# Altium project BIG_FPGA.PrjPcb (part 1 of 2)
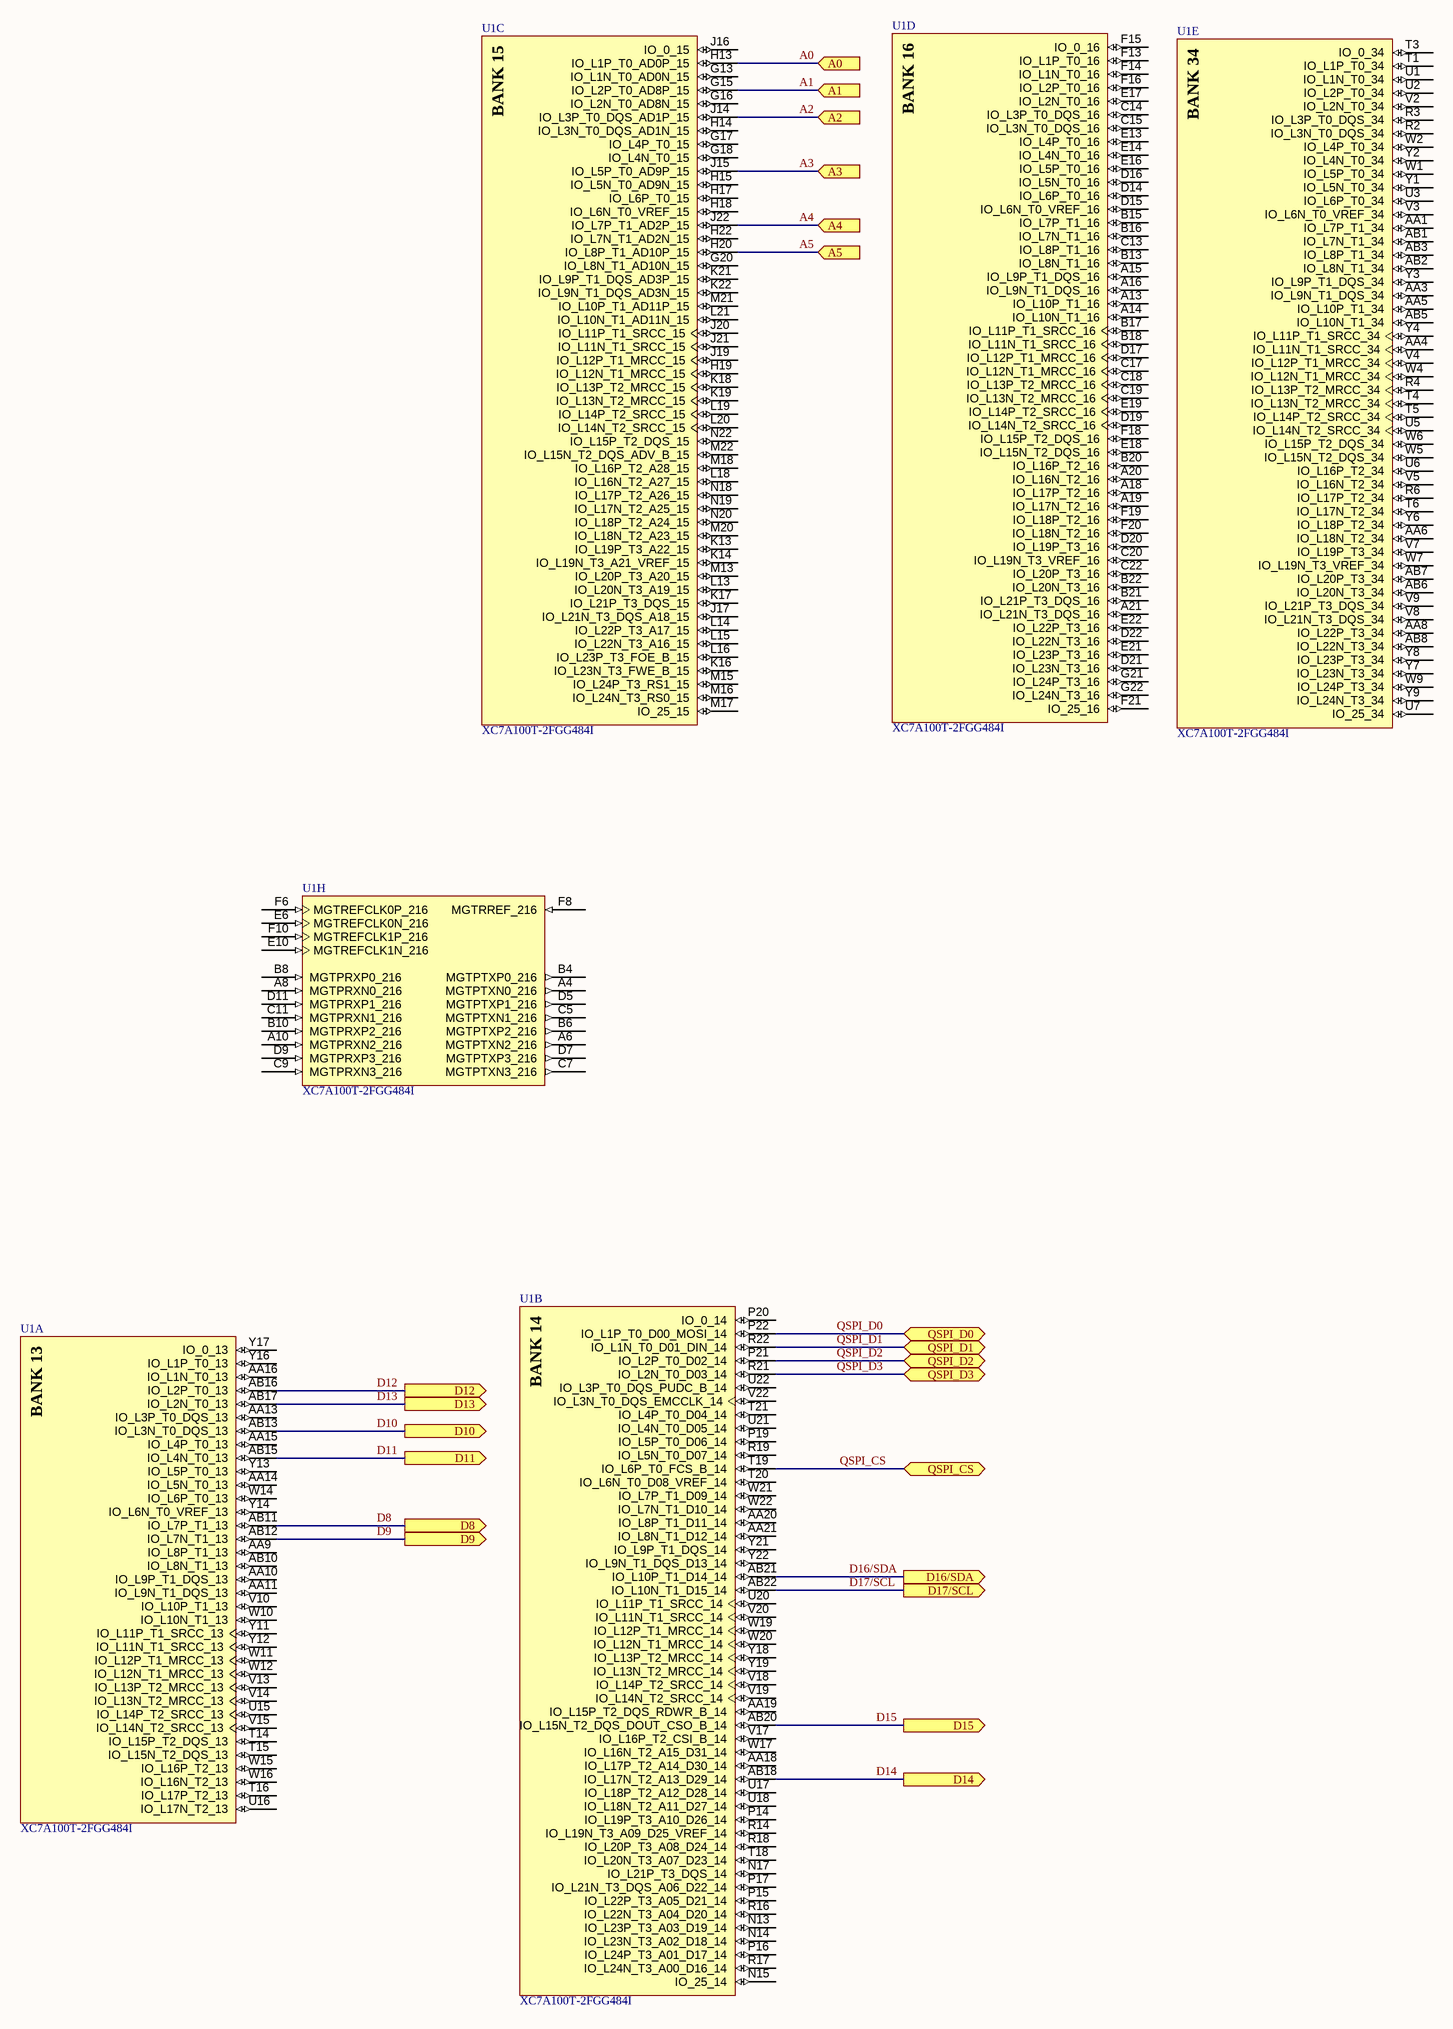
[diagram p0: Sheet1.SchDoc]
CAGE_CODE: ?????; CONTRACT_NUMBER: <CONTRACT NO>; DOC_NO_ASSY_DWG: <ASSY DWG NO>; DOC_NO_BOM: <BOM DOC NO>; DOC_NO_FAB_DWG: <FAB DWG NO>; DOC_NO_SCH_DWG: <SCH DWG NO>; PCB_2_DEC_TOL: +/-.01; PCB_3_DEC_TOL: +/-.010; PCB_ANG_TOL: +/-1/2; PCB_ASSEMBLY_NO: <PCB ASSY NO>; PCB_CHECKER: - -----; PCB_CHECKER_APP_DATE: --/--/----; PCB_DESIGNER: - -----; PCB_DESIGNER_APP_DATE: --/--/----; PCB_DWG_NO: <PCB DWG NO>; PCB_ENGINEER: - -----; PCB_ENGINEER_APP_DATE: --/--/----; PCB_PART_NUMBER: <PCB PN>; PCB_REV: A; SCH_REV: A
7 sheets, 204 parts. Net scope: flat (ports and power ports of the same name join across sheets).
Board file: PCB1.PcbDoc
Sheets:
  Sheet1.SchDoc
  FPGA_PD.SchDoc
  FPGA_DECOUP.SchDoc
  FPGA_ETH.SchDoc
  FPGA_USB.SchDoc
  FPGA_AUDIO.SchDoc
  FPGA_DDR3_Interface.SchDoc

## Sheet Sheet1.SchDoc
size 558 x 431 mm; SheetNumber: 1; SheetTotal: 9; ENG_APP_DATE: --/--/--; DSN_APP_DATE: --/--/--; CHK_APP_DATE: --/--/--

### Parts
U1  XC7A100T-2FGG484I  [FGG484]  (parts A,B,C,D,E,H of 10)

### Ports
A0 (in), A1 (in), A2 (in), A3 (in), A4 (in), A5 (in), D8 (out), D9 (out), D10 (out), D11 (out), D12 (out), D13 (out), D14 (out), D15 (out), D16/SDA (out), D17/SCL (out), QSPI_CS (bidir), QSPI_D0 (bidir), QSPI_D1 (bidir), QSPI_D2 (bidir), QSPI_D3 (bidir)

### Nets
A0: U1.H13(IO_L1P_T0_AD0P_15) ; port A0
A1: U1.G15(IO_L2P_T0_AD8P_15) ; port A1
A2: U1.J14(IO_L3P_T0_DQS_AD1P_15) ; port A2
A3: U1.J15(IO_L5P_T0_AD9P_15) ; port A3
A4: U1.J22(IO_L7P_T1_AD2P_15) ; port A4
A5: U1.H20(IO_L8P_T1_AD10P_15) ; port A5
D8: U1.AB11(IO_L7P_T1_13) ; port D8
D9: U1.AB12(IO_L7N_T1_13) ; port D9
D10: U1.AB13(IO_L3N_T0_DQS_13) ; port D10
D11: U1.AB15(IO_L4N_T0_13) ; port D11
D12: U1.AB16(IO_L2P_T0_13) ; port D12
D13: U1.AB17(IO_L2N_T0_13) ; port D13
D14: U1.AB18(IO_L17N_T2_A13_D29_14) ; port D14
D15: U1.AB20(IO_L15N_T2_DQS_DOUT_CSO_B_14) ; port D15
D16/SDA: U1.AB21(IO_L10P_T1_D14_14) ; port D16/SDA
D17/SCL: U1.AB22(IO_L10N_T1_D15_14) ; port D17/SCL
QSPI_CS: U1.T19(IO_L6P_T0_FCS_B_14) ; port QSPI_CS
QSPI_D0: U1.P22(IO_L1P_T0_D00_MOSI_14) ; port QSPI_D0
QSPI_D1: U1.R22(IO_L1N_T0_D01_DIN_14) ; port QSPI_D1
QSPI_D2: U1.P21(IO_L2P_T0_D02_14) ; port QSPI_D2
QSPI_D3: U1.R21(IO_L2N_T0_D03_14) ; port QSPI_D3

Not connected (* = marked no-connect by the designer): U1 A4(MGTPTXN0_216) A6(MGTPTXN2_216) A8(MGTPRXN0_216) A10(MGTPRXN2_216) A13(IO_L10P_T1_16) A14(IO_L10N_T1_16) A15(IO_L9P_T1_DQS_16) A16(IO_L9N_T1_DQS_16) A18(IO_L17P_T2_16) A19(IO_L17N_T2_16) A20(IO_L16N_T2_16) A21(IO_L21N_T3_DQS_16) AA1(IO_L7P_T1_34) AA3(IO_L9N_T1_DQS_34) AA4(IO_L11N_T1_SRCC_34) AA5(IO_L10P_T1_34) AA6(IO_L18N_T2_34) AA8(IO_L22P_T3_34) AA9(IO_L8P_T1_13) AA10(IO_L9P_T1_DQS_13) AA11(IO_L9N_T1_DQS_13) AA13(IO_L3P_T0_DQS_13) AA14(IO_L5N_T0_13) AA15(IO_L4P_T0_13) AA16(IO_L1N_T0_13) AA18(IO_L17P_T2_A14_D30_14) AA19(IO_L15P_T2_DQS_RDWR_B_14) AA20(IO_L8P_T1_D11_14) AA21(IO_L8N_T1_D12_14) AB1(IO_L7N_T1_34) AB2(IO_L8N_T1_34) AB3(IO_L8P_T1_34) AB5(IO_L10N_T1_34) AB6(IO_L20N_T3_34) AB7(IO_L20P_T3_34) AB8(IO_L22N_T3_34) AB10(IO_L8N_T1_13) B4(MGTPTXP0_216) B6(MGTPTXP2_216) B8(MGTPRXP0_216) B10(MGTPRXP2_216) B13(IO_L8N_T1_16) B15(IO_L7P_T1_16) B16(IO_L7N_T1_16) B17(IO_L11P_T1_SRCC_16) B18(IO_L11N_T1_SRCC_16) B20(IO_L16P_T2_16) B21(IO_L21P_T3_DQS_16) B22(IO_L20N_T3_16) C5(MGTPTXN1_216) C7(MGTPTXN3_216) C9(MGTPRXN3_216) C11(MGTPRXN1_216) C13(IO_L8P_T1_16) C14(IO_L3P_T0_DQS_16) C15(IO_L3N_T0_DQS_16) C17(IO_L12N_T1_MRCC_16) C18(IO_L13P_T2_MRCC_16) C19(IO_L13N_T2_MRCC_16) C20(IO_L19N_T3_VREF_16) C22(IO_L20P_T3_16) D5(MGTPTXP1_216) D7(MGTPTXP3_216) D9(MGTPRXP3_216) D11(MGTPRXP1_216) D14(IO_L6P_T0_16) D15(IO_L6N_T0_VREF_16) D16(IO_L5N_T0_16) D17(IO_L12P_T1_MRCC_16) D19(IO_L14N_T2_SRCC_16) D20(IO_L19P_T3_16) D21(IO_L23N_T3_16) D22(IO_L22N_T3_16) E6(MGTREFCLK0N_216) E10(MGTREFCLK1N_216) E13(IO_L4P_T0_16) E14(IO_L4N_T0_16) E16(IO_L5P_T0_16) E17(IO_L2N_T0_16) E18(IO_L15N_T2_DQS_16) E19(IO_L14P_T2_SRCC_16) E21(IO_L23P_T3_16) E22(IO_L22P_T3_16) F6(MGTREFCLK0P_216) F8(MGTRREF_216) F10(MGTREFCLK1P_216) F13(IO_L1P_T0_16) F14(IO_L1N_T0_16) F15(IO_0_16) F16(IO_L2P_T0_16) F18(IO_L15P_T2_DQS_16) F19(IO_L18P_T2_16) F20(IO_L18N_T2_16) F21(IO_25_16) G13(IO_L1N_T0_AD0N_15) G16(IO_L2N_T0_AD8N_15) G17(IO_L4P_T0_15) G18(IO_L4N_T0_15) G20(IO_L8N_T1_AD10N_15) G21(IO_L24P_T3_16) G22(IO_L24N_T3_16) H14(IO_L3N_T0_DQS_AD1N_15) H15(IO_L5N_T0_AD9N_15) H17(IO_L6P_T0_15) H18(IO_L6N_T0_VREF_15) H19(IO_L12N_T1_MRCC_15) H22(IO_L7N_T1_AD2N_15) J16(IO_0_15) J17(IO_L21N_T3_DQS_A18_15) J19(IO_L12P_T1_MRCC_15) J20(IO_L11P_T1_SRCC_15) J21(IO_L11N_T1_SRCC_15) K13(IO_L19P_T3_A22_15) K14(IO_L19N_T3_A21_VREF_15) K16(IO_L23N_T3_FWE_B_15) K17(IO_L21P_T3_DQS_15) K18(IO_L13P_T2_MRCC_15) K19(IO_L13N_T2_MRCC_15) K21(IO_L9P_T1_DQS_AD3P_15) K22(IO_L9N_T1_DQS_AD3N_15) L13(IO_L20N_T3_A19_15) L14(IO_L22P_T3_A17_15) L15(IO_L22N_T3_A16_15) L16(IO_L23P_T3_FOE_B_15) L18(IO_L16N_T2_A27_15) L19(IO_L14P_T2_SRCC_15) L20(IO_L14N_T2_SRCC_15) L21(IO_L10N_T1_AD11N_15) M13(IO_L20P_T3_A20_15) M15(IO_L24P_T3_RS1_15) M16(IO_L24N_T3_RS0_15) M17(IO_25_15) M18(IO_L16P_T2_A28_15) M20(IO_L18N_T2_A23_15) M21(IO_L10P_T1_AD11P_15) M22(IO_L15N_T2_DQS_ADV_B_15) N13(IO_L23P_T3_A03_D19_14) N14(IO_L23N_T3_A02_D18_14) N15(IO_25_14) N17(IO_L21P_T3_DQS_14) N18(IO_L17P_T2_A26_15) N19(IO_L17N_T2_A25_15) N20(IO_L18P_T2_A24_15) N22(IO_L15P_T2_DQS_15) P14(IO_L19P_T3_A10_D26_14) P15(IO_L22P_T3_A05_D21_14) P16(IO_L24P_T3_A01_D17_14) P17(IO_L21N_T3_DQS_A06_D22_14) P19(IO_L5P_T0_D06_14) P20(IO_0_14) R2(IO_L3N_T0_DQS_34) R3(IO_L3P_T0_DQS_34) R4(IO_L13P_T2_MRCC_34) R6(IO_L17P_T2_34) R14(IO_L19N_T3_A09_D25_VREF_14) R16(IO_L22N_T3_A04_D20_14) R17(IO_L24N_T3_A00_D16_14) R18(IO_L20P_T3_A08_D24_14) R19(IO_L5N_T0_D07_14) T1(IO_L1P_T0_34) T3(IO_0_34) T4(IO_L13N_T2_MRCC_34) T5(IO_L14P_T2_SRCC_34) T6(IO_L17N_T2_34) T14(IO_L15P_T2_DQS_13) T15(IO_L15N_T2_DQS_13) T16(IO_L17P_T2_13) T18(IO_L20N_T3_A07_D23_14) T20(IO_L6N_T0_D08_VREF_14) T21(IO_L4P_T0_D04_14) U1(IO_L1N_T0_34) U2(IO_L2P_T0_34) U3(IO_L6P_T0_34) U5(IO_L14N_T2_SRCC_34) U6(IO_L16P_T2_34) U7(IO_25_34) U15(IO_L14P_T2_SRCC_13) U16(IO_L17N_T2_13) U17(IO_L18P_T2_A12_D28_14) U18(IO_L18N_T2_A11_D27_14) U20(IO_L11P_T1_SRCC_14) U21(IO_L4N_T0_D05_14) U22(IO_L3P_T0_DQS_PUDC_B_14) V2(IO_L2N_T0_34) V3(IO_L6N_T0_VREF_34) V4(IO_L12P_T1_MRCC_34) V5(IO_L16N_T2_34) V7(IO_L19P_T3_34) V8(IO_L21N_T3_DQS_34) V9(IO_L21P_T3_DQS_34) V10(IO_L10P_T1_13) V13(IO_L13P_T2_MRCC_13) V14(IO_L13N_T2_MRCC_13) V15(IO_L14N_T2_SRCC_13) V17(IO_L16P_T2_CSI_B_14) V18(IO_L14P_T2_SRCC_14) V19(IO_L14N_T2_SRCC_14) V20(IO_L11N_T1_SRCC_14) V22(IO_L3N_T0_DQS_EMCCLK_14) W1(IO_L5P_T0_34) W2(IO_L4P_T0_34) W4(IO_L12N_T1_MRCC_34) W5(IO_L15N_T2_DQS_34) W6(IO_L15P_T2_DQS_34) W7(IO_L19N_T3_VREF_34) W9(IO_L24P_T3_34) W10(IO_L10N_T1_13) W11(IO_L12P_T1_MRCC_13) W12(IO_L12N_T1_MRCC_13) W14(IO_L6P_T0_13) W15(IO_L16P_T2_13) W16(IO_L16N_T2_13) W17(IO_L16N_T2_A15_D31_14) W19(IO_L12P_T1_MRCC_14) W20(IO_L12N_T1_MRCC_14) W21(IO_L7P_T1_D09_14) W22(IO_L7N_T1_D10_14) Y1(IO_L5N_T0_34) Y2(IO_L4N_T0_34) Y3(IO_L9P_T1_DQS_34) Y4(IO_L11P_T1_SRCC_34) Y6(IO_L18P_T2_34) Y7(IO_L23N_T3_34) Y8(IO_L23P_T3_34) Y9(IO_L24N_T3_34) Y11(IO_L11P_T1_SRCC_13) Y12(IO_L11N_T1_SRCC_13) Y13(IO_L5P_T0_13) Y14(IO_L6N_T0_VREF_13) Y16(IO_L1P_T0_13) Y17(IO_0_13) Y18(IO_L13P_T2_MRCC_14) Y19(IO_L13N_T2_MRCC_14) Y21(IO_L9P_T1_DQS_14) Y22(IO_L9N_T1_DQS_D13_14)

### Notes on the sheet
- DWG. NO.
- REV.
- SHT.
- REVISION
- DESCRIPTION
- DATE
- APPROVED
- THIS DOCUMENT AND THE DATA DISCLOSED HEREIN OR HEREWITH IS THE PROPERTY OF ALTIUM LIMITED AND MAY BE FREELY DISTRIBUTED IN WHOLE. NO RIGHTS ARE RESERVED OR EXPRESS OR IMPLIED WARANTEE GIVEN.
- ENG:
- DSN:
- APPROVALS
- PROJECT
- DOCUMENT REVISION:
- DESIGN ITEM:
- CHK:
- BOM:
- REFERENCE DOCUMENTS
- PROJECT REVISION:
- TITLE
- FAB DWG:
- PCB DWG:
- ASSY DWG:
- SCALE:
- SIZE
- C
- CAGE CODE
- FILE NAME
- DWG NO.
- SHEET
- OF
- REV
- (in symbol CMP-0364-00030-3, part A) BANK 13
- (in symbol CMP-0364-00030-3, part B) BANK 14
- (in symbol CMP-0364-00030-3, part C) BANK 15
- (in symbol CMP-0364-00030-3, part D) BANK 16
- (in symbol CMP-0364-00030-3, part E) BANK 34

### Library data of the parts
U1 = CMP-0364-00030-3: Artix-7 FPGA, 285 User I/Os, 4 GTP, 484-Ball BGA, Speed Grade 2, Industrial Grade, Pb-Free; Manufacturer: Xilinx; DSP48E1 Slices: 240; Speed Grade: -2; Clock Mgmt Tiles (CMTs): 6; Block RAM Blocks (Max Kb): 4860; Max User I/O: 300; Block RAM Blocks (18Kb): 270; CLBs (Slices): 15850; Logic Cells: 101440; Block RAM Blocks (36Kb): 135; ComponentLink2URL: http://www.xilinx.com/support/documentation/user_guides/ug475_7Series_Pkg_Pinout.pdf; DatasheetVersion: v1.12; PartNumber: XC7A100T-2FGG484I; ComponentLink5Description: Packaging and Pinout; PackageDescription: Wire-Bond Fine-Pitch BGA, Body 23 x 23 mm, 1.0 mm Pitch; Mounting Technology: Surface Mount; ComponentLink1Description: Datasheet; ComponentLink4URL: http://www.xilinx.com/support/packagefiles/a7packages/xc7a100tfgg484pkg.txt; PackageVersion: Rev 1.8; NexusDeviceID: XC7A100T-2FGG484I; ComponentLink5URL: http://www.xilinx.com/support/documentation/user_guides/ug475_7Series_Pkg_Pinout.pdf; Code_JEDEC: MS-034-AAJ-1; Generic Part Number: XC7A100T; ComponentLink4Description: Package File; ComponentLink3Description: DC and Switching Characteristics; ComponentLink1URL: http://www.xilinx.com/support/documentation/data_sheets/ds180_7Series_Overview.pdf; CLBs (Max Distributed RAM Kb): 1188; ComponentLink2Description: Package Specification; RoHS: Pb-Free; ComponentLink3URL: http://www.xilinx.com/support/documentation/data_sheets/ds181_Artix_7_Data_Sheet.pdf; PackageReference: FGG484

## Sheet FPGA_PD.SchDoc
size A4; SheetNumber: 5; SheetTotal: 9
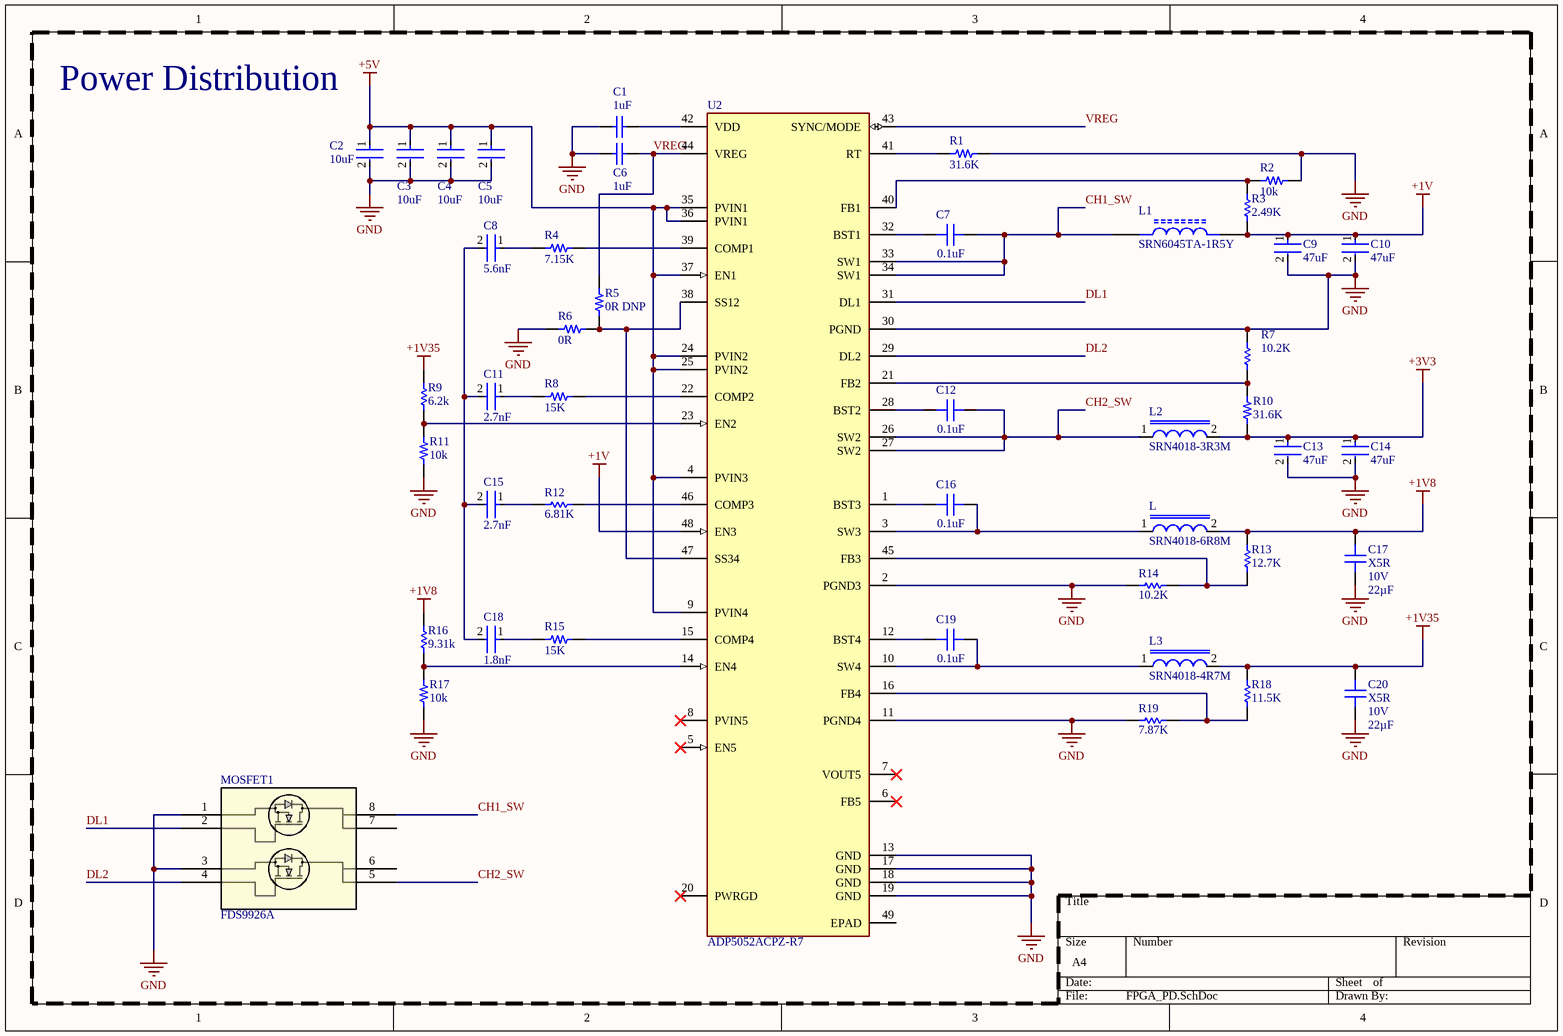
[diagram p1: FPGA_PD.SchDoc]

### Parts
C1  1uF  [CAPC1005X55X25LL05T10]
C2  10uF  [FP-GRM155-0_2-IPC_A]
C3  10uF  [FP-GRM155-0_2-IPC_A]
C4  10uF  [FP-GRM155-0_2-IPC_A]
C5  10uF  [FP-GRM155-0_2-IPC_A]
C6  1uF  [CAPC1005X55X25LL05T10]
C7  Capacitance: 0.1uF  [CAP 0603_1608]  (hidden comment: CAP CER 0.1UF 100V 10% X7R 0603)
C8  5.6nF  [FP-GRM188-0_1-e0_2_0_5-IPC_A]
C9  47uF  [FP-GRM21B-0_2-MFG]
C10  47uF  [FP-GRM21B-0_2-MFG]
C11  2.7nF  [FP-GRM188-0_1-e0_2_0_5-MFG]
C12  Capacitance: 0.1uF  [CAP 0603_1608]  (hidden comment: CAP CER 0.1UF 100V 10% X7R 0603)
C13  47uF  [FP-GRM21B-0_2-MFG]
C14  47uF  [FP-GRM21B-0_2-MFG]
C15  2.7nF  [FP-GRM188-0_1-e0_2_0_5-MFG]
C16  Capacitance: 0.1uF  [CAP 0603_1608]  (hidden comment: CAP CER 0.1UF 100V 10% X7R 0603)
C17  Dielectric Code: X5R  Voltage Rating: 10V  Capacitance: 22µF  [CAP 0603_1608]  (hidden comment: CAP CER 22UF 10V 20% X5R 0603)
C18  1.8nF  [FP-GRM188-0_1-e0_2_0_5-IPC_B]
C19  Capacitance: 0.1uF  [CAP 0603_1608]  (hidden comment: CAP CER 0.1UF 100V 10% X7R 0603)
C20  Dielectric Code: X5R  Voltage Rating: 10V  Capacitance: 22µF  [CAP 0603_1608]  (hidden comment: CAP CER 22UF 10V 20% X5R 0603)
L  SRN4018-6R8M  [INDP4040X180N - duplicate]
L1  SRN6045TA-1R5Y  [IND_SRN6045TA-1R5Y]
L2  SRN4018-3R3M  [INDP4040X180N - duplicate]
L3  SRN4018-4R7M  [FP-SRN4018-MFG]
MOSFET1  FDS9926A  [SOIC8_751EB_ONS-M]
R1  31.6K  [RES 0603_1608]
R2  10k  [RES 0603_1608]
R3  2.49K  [RESC1608X55X30ML20T20]
R4  7.15K  [FP-AC0603-IPC_A]
R5  0R DNP  [RES 0603_1608]
R6  0R  [RES 0603_1608]
R7  10.2K  [RESC1608X55X25LL10T15]
R8  15K  [RES 0603_1608]
R9  6.2k  [RESC1608X55X25ML10T15]
R10  31.6K  [RES 0603_1608]
R11  10k  [RES 0603_1608]
R12  6.81K  [RESC1608X55X25ML10T15]
R13  12.7K  [RESC1608X55X30LL15T15]
R14  10.2K  [RESC1608X55X25LL10T15]
R15  15K  [RES 0603_1608]
R16  9.31k  [RESC1608X55X25LL10T15]
R17  10k  [RES 0603_1608]
R18  11.5K  [RESC1608X55X25LL10T15]
R19  7.87K  [RESC1608X55X25NL10T15]
U2  ADP5052ACPZ-R7  [FP-CP-48-13-IPC_A]

### Nets
+1V: C9.1 C10.1 L1.2 R3.1 U2.48(EN3)
+1V8: C17.1 L.2 R13.2 R16.1
+1V35: C20.1 L3.2 R9.1 R18.1
+3V3: C13.1 C14.1 L2.2 R10.2
+5V: C2.1 C3.1 C4.1 C5.1 U2.4(PVIN3) U2.9(PVIN4) U2.24(PVIN2) U2.25(PVIN2) U2.35(PVIN1) U2.36(PVIN1) U2.37(EN1)
GND: C1.1 C2.2 C3.2 C4.2 C5.2 C6.1 C9.2 C10.2 C13.2 C14.2 C17.2 C20.2 MOSFET1.1 MOSFET1.3 R1.2 R2.1 R6.1 R7.1 R11.2 R14.2 R17.2 R19.1 U2.2(PGND3) U2.11(PGND4) U2.13(GND) U2.17(GND) U2.18(GND) U2.19(GND) U2.30(PGND)
CH1_SW: C7.1 L1.1 MOSFET1.8 U2.33(SW1) U2.34(SW1)
CH2_SW: C12.1 L2.1 MOSFET1.5 U2.26(SW2) U2.27(SW2)
DL1: MOSFET1.2 U2.31(DL1)
DL2: MOSFET1.4 U2.29(DL2)
VREG: C6.2 R5.2 U2.43(SYNC/MODE) U2.44(VREG)
NetC1_2: C1.2 U2.42(VDD)
NetC7_2: C7.2 U2.32(BST1)
NetC8_1: C8.1 R4.1
NetC8_2: C8.2 C11.2 C15.2 C18.2
NetC11_1: C11.1 R8.1
NetC12_2: C12.2 U2.28(BST2)
NetC15_1: C15.1 R12.1
NetC16_1: C16.1 L.1 U2.3(SW3)
NetC16_2: C16.2 U2.1(BST3)
NetC18_1: C18.1 R15.1
NetC19_1: C19.1 L3.1 U2.10(SW4)
NetC19_2: C19.2 U2.12(BST4)
NetR1_1: R1.1 U2.41(RT)
NetR2_2: R2.2 R3.2 U2.40(FB1)
NetR4_2: R4.2 U2.39(COMP1)
NetR5_1: R5.1 R6.2 U2.38(SS12) U2.47(SS34)
NetR7_2: R7.2 R10.1 U2.21(FB2)
NetR8_2: R8.2 U2.22(COMP2)
NetR9_2: R9.2 R11.1 U2.23(EN2)
NetR12_2: R12.2 U2.46(COMP3)
NetR13_1: R13.1 R14.1 U2.45(FB3)
NetR15_2: R15.2 U2.15(COMP4)
NetR16_2: R16.2 R17.1 U2.14(EN4)
NetR18_2: R18.2 R19.2 U2.16(FB4)

Not connected (* = marked no-connect by the designer): MOSFET1 6 7; U2 5(EN5)* 6(FB5)* 7(VOUT5)* 8(PVIN5)* 20(PWRGD)* 49(EPAD)

### Notes on the sheet
- Power Distribution

### Library data of the parts
C1 C6 = CMP-2008-03928-1: Manufacturer: Murata; Part Number: GRM155R71C104KA88J
C2-C5 = CMP-06035-026070-1: Chip Multilayer Ceramic Capacitors for General Purpose, 0402, 10uF, X5R, 15%, 20%, 10V
C7 C12 C16 C19 = CMP-013-0022-14: Ceramic Capacitor, Multilayer, Ceramic, 100V, 10% +Tol, 10% -Tol, X7R, 15% TC, 0.1uF, Surface Mount, 0603; Case/Package: 0603; Tolerance: 10%
C8 = CMP-06035-024846-1: Chip Multilayer Ceramic Capacitors for General Purpose, 0603, 5600pF, C0G, 30ppm/°C, 5%, 50V; Width: 0.031inch; Case Code (Metric): 1608; Voltage Rating (DC): 50V; Length: 1.6mm; Termination: SMD/SMT; Packaging: Tape and Reel; Lead Pitch: 0.5mm; Package Quantity: 4000; Max Operating Temperature: 125°C; Thickness: 0.035inch; Tolerance: 5%; Dielectric: C0G; Depth: 0.8mm; Mount: Surface Mount; Min Operating Temperature: -55°C; Case Code (Imperial): 0603; Case/Package: 0603; Lead Free: Lead Free; Height: 0.8mm; Capacitance: 5.6nF; Voltage Rating: 50V
C9 C10 C13 C14 = CMP-2007-03221-2: CAP CER 47UF 6.3V X5R 0805; Tolerance: 20%; Min Operating Temperature: -55°C; Depth: 1.25mm; Thickness: 0.057inch; RoHS Compliant: Yes; Dielectric: X5R; Voltage Rating: 6.3V; Case/Package: 0805; Height: 1.25mm; Package Quantity: 3000; Case Code (Metric): 2012; Termination: SMD/SMT; Packaging: Tape and Reel; Voltage Rating (DC): 6.3V; Weight: 0.000335oz; Width: 0.049inch; Capacitance: 47uF; Length: 2mm; Lead Free: Lead Free; Max Operating Temperature: 85°C; Voltage: 6.3V; REACH SVHC: No SVHC; Mount: Surface Mount; Case Code (Imperial): 0805
C11 C15 = CMP-2006-02644-2: Chip Multilayer Ceramic Capacitors for General Purpose, 0603, 2700pF, C0G, 30ppm/°C, 5%, 50V; Thickness: 0.035inch; Height: 0.8mm; Case Code (Metric): 1608; Max Operating Temperature: 125°C; Voltage Rating (DC): 50V; Voltage: 50V; Package Quantity: 1; Radiation Hardening: No; Termination: SMD/SMT; Depth: 0.8mm; Packaging: Tape and Reel; Dielectric: C0G; REACH SVHC: No SVHC; Lead Free: Lead Free; Case Code (Imperial): 0603; Temperature Coefficient: 30ppm/°C; Min Operating Temperature: -55°C; Mount: Surface Mount; Case/Package: 0603; Capacitance: 2.7nF; Voltage Rating: 50V; Tolerance: 5%; Length: 1.6mm; Width: 0.031inch
C17 C20 = CMP-013-0021-7: Ceramic Capacitor, Multilayer, Ceramic, 10V, 20% +Tol, 20% -Tol, X5R, 15% TC, 22uF, Surface Mount, 0603; Case/Package: 0603; Tolerance: 20%
C18 = CMP-2006-02620-2: Chip Multilayer Ceramic Capacitors for General Purpose, 0603, 1800pF, C0G, 30ppm/°C, 5%, 50V; Thickness: 0.035inch; Case Code (Metric): 1608; Voltage Rating (DC): 50V; Packaging: Tape and Reel; Voltage Rating: 50V; Dielectric: C0G; Voltage: 50V; Length: 1.6mm; Package Quantity: 10000; Termination: SMD/SMT; Min Operating Temperature: -55°C; Max Operating Temperature: 125°C; Height: 0.8mm; Case/Package: 0603; Mount: Surface Mount; Case Code (Imperial): 0603; Radiation Hardening: No; Capacitance: 1.8nF; Depth: 0.8mm; Width: 0.031inch; Tolerance: 5%
L = SRN4018-6R8M: 6.8ÂµH Semi-Shielded Wirewound Inductor 1.5A 118mOhm Max Nonstandard; MF: Bourns; SnapEDA_Link: https://www.snapeda.com/parts/SRN4018-6R8M/Bourns/view-part/447321/?ref=snap; Availability: Unavailable; Value: *; Price: None; MP: SRN4018-6R8M; Package: Nonstandard Bourns
L1 = SRN6045TA-1R5Y: Inductor Power Semi-Shielded Wirewound 220uH 20% 1MHz 15Q-Factor Ferrite 600mA 900mOhm DCR 2424 Automotive T/R; Package: None; Price: None; Value: *; MP: SRN6045TA-1R5Y; Availability: Unavailable
L2 = SRN4018-3R3M: 3.3ÂµH Semi-Shielded Wirewound Inductor 2.2A 66mOhm Max Nonstandard; MF: Bourns; SnapEDA_Link: https://www.snapeda.com/parts/SRN4018-3R3M/Bourns/view-part/485003/?ref=snap; Mouser-Purchase-URL: https://snapeda.com/shop?store=Mouser&id=485003; Availability: Good; DigiKey-Purchase-URL: https://snapeda.com/shop?store=DigiKey&id=485003; MP: SRN4018-3R3M; Package: Nonstandard Bourns; Value: *; Price: None; Arrow_Electronics-Purchase-URL: https://snapeda.com/shop?store=Arrow+Electronics&id=485003; Arrow_Europe-Purchase-URL: https://snapeda.com/shop?store=Arrow+Europe&id=485003
L3 = CMP-07248-000014-1: FIXED IND 4.7UH 1.9A 84 MOHM SMD; Manufacturer: Bourns; Q Factor: 9; Series Resistance: 0.084Ω; Test Frequency: 7.96MHz; Self Resonant Frequency: 35MHz; Tolerance: 20%; Core Material: Ferrite; Shielding: true; Saturation Current: 2A; Lead Free: Yes; Rms Current: 1.9A; Temperature: -40°C to +125°C; Value: 4.7uH; Inductance: 4.7uH; Device Class L1: Passive Components; Automotive: No; Octopart: https://octopart.com/srn4018-4r7m-bourns-25452396; Mouser Description: Fixed Inductors 4.7uH 20% SMD 4018; Package: SRN4018; Height: 1.8mm; Device Class L3: Fixed Inductors; ComponentLink2Description: Datasheet; Composition: Wirewound; Category: Ind; RoHS: TRUE; Manufacturer Part Number: SRN4018-4R7M; ComponentLink2URL: https://www.bourns.com/docs/Product-Datasheets/SRN4018.pdf; Temperature Range High: +125°C; Temperature Range Low: -40°C; Digikey Description: FIXED IND 4.7UH 1.9A 84 MOHM SMD; Device Class L2: Inductors
MOSFET1 = FDS9926A: No Description Available; Mfr_Name: onsemi; RefDes: RefDes; Type: Type
R1 R10 = CMP-00065-1: Fixed Resistor, Metal Glaze/thick Film, 0.1W, 31600ohm, 75V, 1% +/-Tol, 100ppm/Cel, Surface Mount, 0603; Temperature Coefficient: 100ppm/°C; Case/Package: 0603; Voltage Rating: 75V
R2 R11 R17 = CMP-009-00190-14: 10 ±1% 0.1W, 1/10W Chip Resistor 0603 (1608 Metric) Automotive AEC-Q200 Thick Film; Voltage Rating: 75V; Temperature Coefficient: 100ppm/°C; Case/Package: 0603
R3 = CMP-2000-00003-1: Part Number: ERA3AEB2491V; Manufacturer: Panasonic
R4 = CMP-03412-024834-2: RES 7.15KΩ 1.00% 0.1W 0603; Power Rating: 100mW; Voltage Rating: 50V; Temperature Coefficient: 100ppm/°C; Tolerance: 1%; Resistance: 7.15kR; Max Power Dissipation: 100mW; Resistor Type: Thick Film; Height: 0.022inch; Termination: SMD/SMT; Case/Package: 0603; Max Operating Temperature: 155°C; Width: 0.8mm; Case Code (Imperial): 0603; Min Operating Temperature: -55°C; Case Code (Metric): 1608; RoHS Compliant: Yes; Weight: 7.1E-05oz; Number of Terminations: 2; Length: 0.063inch; Packaging: Tape and Reel; Features: Moisture Resistant; Series: AC
R5 R6 = CMP-010-0000-7: Fixed Resistor, Metal Glaze/thick Film, 0.1W, 0ohm, Surface Mount, 0603; Voltage Rating: 75V; Temperature Coefficient: 0ppm/°C; Case/Package: 0603
R7 R14 = CMP-2000-06926-1: Chip Resistor, 10.2 KOhm, +/- 1%, 0.1 W, -55 to 155 degC, 0603 (1608 Metric), RoHS, Tape and Reel; Brand: Yageo; Power Rating: 100mW; Voltage Rating: 75V; Resistance: 10.2kOhms; Unit Weight: 0.000071oz; Temperature Coefficient: 100PPM/C; Package Reference: 0603; Product: ThickFilmResistorsGeneralPurpose; Series: RC; Tolerance: 1%; Datasheet Version: Rev. 7, 05/2017; Case Code - in: 0603; Packaging: Reel; Manufacturer URL: http://www.yageo.com/; Manufacturer: Yageo; Package / Case: 0603(1608metric); Width: 0.8mm; Operating Temperature Range: -55Cto+155C; Package Description: 2-Pin Surface Mount Device, Body 1.6 x 0.8 mm; RoHS: True; Height: 0.45mm; Termination Style: SMD/SMT; Product Category: ThickFilmResistors; Type: GeneralPurposeChipResistorSurfaceMount; Case Code - mm: 1608; Datasheet URL: http://www.yageo.com/documents/recent/PYu-RC_Group_51_RoHS_L_7.pdf; Length: 1.6mm; Mounting Technology: SurfaceMount
R8 R15 = CMP-010-0035-11: 15 kOhms ±1% 0.1W, 1/10W Chip Resistor 0603 (1608 Metric) Moisture Resistant Thick Film; Temperature Coefficient: 100ppm/°C; Voltage Rating: 75V; Case/Package: 0603
R9 = CMP-2000-04287-1: Part Number: RC0603JR-076K2L; Manufacturer: Yageo
R12 = CMP-2000-04120-1: Part Number: RC0603FR-076K81L; Manufacturer: Yageo
R13 = CMP-2000-00228-1: Manufacturer: Panasonic; Part Number: ERJ-3EKF1272V
R16 = CMP-2000-04169-1: Part Number: RC0603FR-079K31L; Manufacturer: Yageo
R18 = CMP-2000-04891-1: Manufacturer: Yageo; Part Number: RC0603FR-0711K5L
R19 = CMP-2000-04136-1: Part Number: RC0603FR-07787KL; Manufacturer: Yageo
U2 = CMP-00026-22488692-1: ADP5052ACPZ-R7 5-Channel Integrated Power Solution with Quad Buck Regulators and 200 mA LDO Regulator; Manufacturer Lifecycle Status: PRODUCTION; Switching Frequency: 740kHz; Min Input Voltage: 4.5V; Output Type: Adjustable, Fixed; Max Junction Temperature (Tj): 125°C; Nominal Supply Current: 4.8mA; Max Duty Cycle: 50%; Voltage - Output 3: 1.8V; Current - Output 3: 1.2A; Max Input Voltage: 15V; Voltage - Output 2: 5V; Max Output Current: 4kA; Output Voltage: 3.305V; Output Current: 200mA; Max Output Voltage: 13.5V; Voltage - Output 1: 1.6V; Number of Outputs: 5; Min Output Voltage: 800mV; Max Operating Temperature: 125°C; REACH SVHC: No SVHC; Mount: Surface Mount; Lead Free: Contains Lead; NexarPartId: 22488692; Contact Plating: Tin; Number of Pins: 48; Lifecycle Status: Production; Case/Package: LFCSP EP; Min Supply Voltage: 4.5V; Min Operating Temperature: -40°C; RoHS: Compliant; Width: 7.1mm; Packaging: Cut Tape (CT); Height: 730µm; Max Supply Voltage: 15V; Schedule B: 8542390000, 8542390000; Operating Supply Voltage: 15V; Length: 7mm

## Sheet FPGA_DECOUP.SchDoc
size A3; SheetNumber: 7; SheetTotal: 9
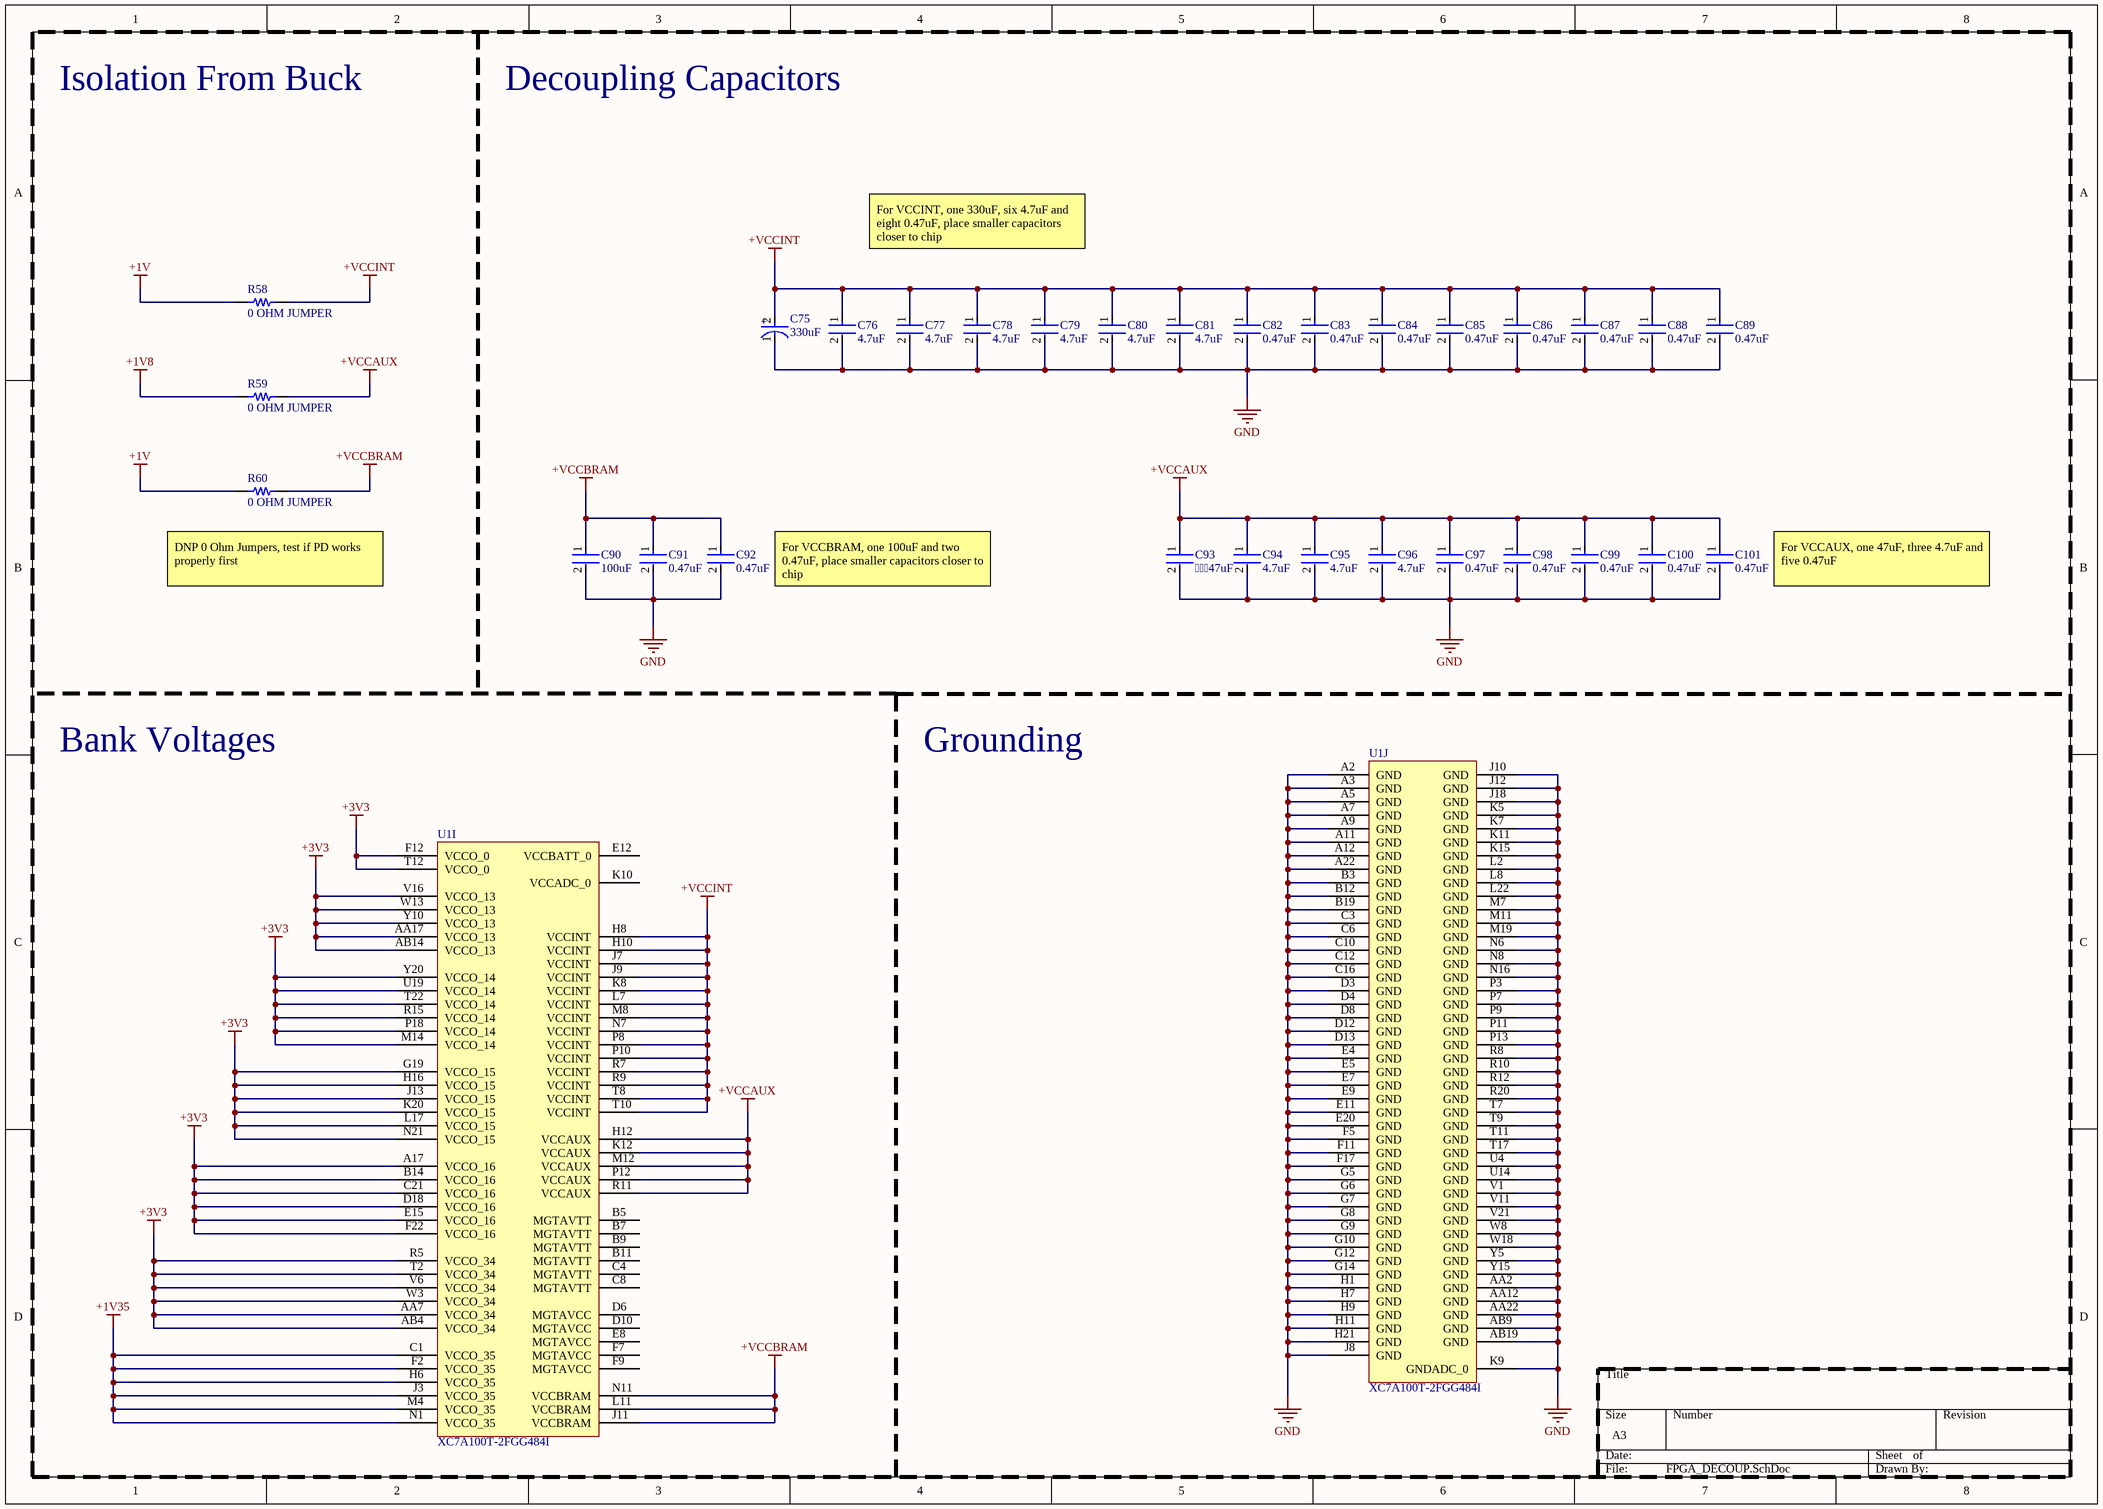
[diagram p2: FPGA_DECOUP.SchDoc]

### Parts
C75  330uF  [FP-T495X336M035ATE100-MFG]
C76  4.7uF  [FP-GRM155-0_1-IPC_B]
C77  4.7uF  [FP-GRM155-0_1-IPC_B]
C78  4.7uF  [FP-GRM155-0_1-IPC_B]
C79  4.7uF  [FP-GRM155-0_1-IPC_B]
C80  4.7uF  [FP-GRM155-0_1-IPC_B]
C81  4.7uF  [FP-GRM155-0_1-IPC_B]
C82  0.47uF  [FP-GRM15-0_1-MFG]
C83  0.47uF  [FP-GRM15-0_1-MFG]
C84  0.47uF  [FP-GRM15-0_1-MFG]
C85  0.47uF  [FP-GRM15-0_1-MFG]
C86  0.47uF  [FP-GRM15-0_1-MFG]
C87  0.47uF  [FP-GRM15-0_1-MFG]
C88  0.47uF  [FP-GRM15-0_1-MFG]
C89  0.47uF  [FP-GRM15-0_1-MFG]
C90  100uF  [FP-GRM32E-0_3-0_2-IPC_B]
C91  0.47uF  [FP-GRM15-0_1-MFG]
C92  0.47uF  [FP-GRM15-0_1-MFG]
C93  47uF  [FP-GRM32E-0_3-0_2-MFG]
C94  4.7uF  [FP-GRM155-0_1-IPC_B]
C95  4.7uF  [FP-GRM155-0_1-IPC_B]
C96  4.7uF  [FP-GRM155-0_1-IPC_B]
C97  0.47uF  [FP-GRM15-0_1-MFG]
C98  0.47uF  [FP-GRM15-0_1-MFG]
C99  0.47uF  [FP-GRM15-0_1-MFG]
C100  0.47uF  [FP-GRM15-0_1-MFG]
C101  0.47uF  [FP-GRM15-0_1-MFG]
R58  0 OHM JUMPER  [RES 0603_1608]
R59  0 OHM JUMPER  [RES 0603_1608]
R60  0 OHM JUMPER  [RES 0603_1608]
U1  XC7A100T-2FGG484I  [FGG484]  (parts I,J of 10)

### Nets
+1V: R58.1 R60.1
+1V8: R59.1
+1V35: U1.C1(VCCO_35) U1.F2(VCCO_35) U1.H6(VCCO_35) U1.J3(VCCO_35) U1.M4(VCCO_35) U1.N1(VCCO_35)
+3V3: U1.A17(VCCO_16) U1.AA7(VCCO_34) U1.AA17(VCCO_13) U1.AB4(VCCO_34) U1.AB14(VCCO_13) U1.B14(VCCO_16) U1.C21(VCCO_16) U1.D18(VCCO_16) U1.E15(VCCO_16) U1.F12(VCCO_0) U1.F22(VCCO_16) U1.G19(VCCO_15) U1.H16(VCCO_15) U1.J13(VCCO_15) U1.K20(VCCO_15) U1.L17(VCCO_15) U1.M14(VCCO_14) U1.N21(VCCO_15) U1.P18(VCCO_14) U1.R5(VCCO_34) U1.R15(VCCO_14) U1.T2(VCCO_34) U1.T12(VCCO_0) U1.T22(VCCO_14) U1.U19(VCCO_14) U1.V6(VCCO_34) U1.V16(VCCO_13) U1.W3(VCCO_34) U1.W13(VCCO_13) U1.Y10(VCCO_13) U1.Y20(VCCO_14)
+VCCAUX: C93.1 C94.1 C95.1 C96.1 C97.1 C98.1 C99.1 C100.1 C101.1 R59.2 U1.H12(VCCAUX) U1.K12(VCCAUX) U1.M12(VCCAUX) U1.P12(VCCAUX) U1.R11(VCCAUX)
+VCCBRAM: C90.1 C91.1 C92.1 R60.2 U1.J11(VCCBRAM) U1.L11(VCCBRAM) U1.N11(VCCBRAM)
+VCCINT: C75.2(A) C76.1 C77.1 C78.1 C79.1 C80.1 C81.1 C82.1 C83.1 C84.1 C85.1 C86.1 C87.1 C88.1 C89.1 R58.2 U1.H8(VCCINT) U1.H10(VCCINT) U1.J7(VCCINT) U1.J9(VCCINT) U1.K8(VCCINT) U1.L7(VCCINT) U1.M8(VCCINT) U1.N7(VCCINT) U1.P8(VCCINT) U1.P10(VCCINT) U1.R7(VCCINT) U1.R9(VCCINT) U1.T8(VCCINT) U1.T10(VCCINT)
GND: C75.1(C) C76.2 C77.2 C78.2 C79.2 C80.2 C81.2 C82.2 C83.2 C84.2 C85.2 C86.2 C87.2 C88.2 C89.2 C90.2 C91.2 C92.2 C93.2 C94.2 C95.2 C96.2 C97.2 C98.2 C99.2 C100.2 C101.2 U1.A2(GND) U1.A3(GND) U1.A5(GND) U1.A7(GND) U1.A9(GND) U1.A11(GND) U1.A12(GND) U1.A22(GND) U1.AA2(GND) U1.AA12(GND) U1.AA22(GND) U1.AB9(GND) U1.AB19(GND) U1.B3(GND) U1.B12(GND) U1.B19(GND) U1.C3(GND) U1.C6(GND) U1.C10(GND) U1.C12(GND) U1.C16(GND) U1.D3(GND) U1.D4(GND) U1.D8(GND) U1.D12(GND) U1.D13(GND) U1.E4(GND) U1.E5(GND) U1.E7(GND) U1.E9(GND) U1.E11(GND) U1.E20(GND) U1.F5(GND) U1.F11(GND) U1.F17(GND) U1.G5(GND) U1.G6(GND) U1.G7(GND) U1.G8(GND) U1.G9(GND) U1.G10(GND) U1.G12(GND) U1.G14(GND) U1.H1(GND) U1.H7(GND) U1.H9(GND) U1.H11(GND) U1.H21(GND) U1.J8(GND) U1.J10(GND) U1.J12(GND) U1.J18(GND) U1.K5(GND) U1.K7(GND) U1.K9(GNDADC_0) U1.K11(GND) U1.K15(GND) U1.L2(GND) U1.L8(GND) U1.L22(GND) U1.M7(GND) U1.M11(GND) U1.M19(GND) U1.N6(GND) U1.N8(GND) U1.N16(GND) U1.P3(GND) U1.P7(GND) U1.P9(GND) U1.P11(GND) U1.P13(GND) U1.R8(GND) U1.R10(GND) U1.R12(GND) U1.R20(GND) U1.T7(GND) U1.T9(GND) U1.T11(GND) U1.T17(GND) U1.U4(GND) U1.U14(GND) U1.V1(GND) U1.V11(GND) U1.V21(GND) U1.W8(GND) U1.W18(GND) U1.Y5(GND) U1.Y15(GND)

Not connected (* = marked no-connect by the designer): U1 B5(MGTAVTT) B7(MGTAVTT) B9(MGTAVTT) B11(MGTAVTT) C4(MGTAVTT) C8(MGTAVTT) D6(MGTAVCC) D10(MGTAVCC) E8(MGTAVCC) E12(VCCBATT_0) F7(MGTAVCC) F9(MGTAVCC) K10(VCCADC_0)

### Notes on the sheet
- Isolation From Buck
- Decoupling Capacitors
- For VCCINT, one 330uF, six 4.7uF and eight 0.47uF, place smaller capacitors closer to chip
- (near R60) DNP 0 Ohm Jumpers, test if PD works properly first
- For VCCBRAM, one 100uF and two 0.47uF, place smaller capacitors closer to chip
- For VCCAUX, one 47uF, three 4.7uF and five 0.47uF
- Bank Voltages
- Grounding
- (in symbol CMP-03017-000065-1) +

### Library data of the parts
C75 = CMP-03017-000065-1: CAP TANT 33UF 20% 35V 2917; Polarity: Polar; Dissipation Factor: 6%; ESR (Equivalent Series Resistance): 100mR; Case Code (Imperial): 2917; Termination: SMD/SMT; Radiation Hardening: No; Width: 4.3mm; Case Code (Metric): 7343; Depth: 4.3mm; Height: 4.3mm; Capacitance: 33uF; Series: T495; Max Operating Temperature: 125°C; Voltage Rating (DC): 35V; Construction: Flat; Min Operating Temperature: -55°C; Packaging: Tape and Reel; Length: 7.3mm; RoHS Compliant: Yes; Tolerance: 20%; Case/Package: Molded; Weight: 0.023634oz; Voltage Rating: 35V
C76-C81 C94-C96 = CMP-2008-04549-2: Chip Multilayer Ceramic Capacitors for General Purpose, 0402, 4.7uF, X5R, 15%, 20%, 6.3V; Height: 0.5mm; Weight: 0.000212oz; Length: 1mm; Case Code (Metric): 1005; Packaging: Tape and Reel; Termination: SMD/SMT; Dielectric: X5R; Depth: 0.5mm; Case Code (Imperial): 0402; Min Operating Temperature: -55°C; Case/Package: 0402; Voltage: 6.3V; Width: 0.02inch; Capacitance: 4.7uF; Lead Free: Lead Free; Thickness: 0.022inch; Contact Plating: Tin; REACH SVHC: No SVHC; Package Quantity: 10000; Tolerance: 20%; Voltage Rating (DC): 6.3V; Voltage Rating: 6.3V; Mount: Surface Mount; Max Operating Temperature: 85°C
C82-C89 C91 C92 C97-C101 = CMP-2000-05009-2: CAP CER 0.47UF 10V X5R 0402; Manufacturer: Murata Electronics North America; Manufacturer Part Number: GRM155R61A474KE15D; Temperature Coefficient: 15%; Material: Ceramic; Tolerance: 10%; Description: 0.47µF ±10% 10V Ceramic Capacitor X5R 0402 (1005 Metric); Device Class L3: Ceramic Capacitors; ComponentLink2Description: Datasheet; ComponentLink2URL: https://search.murata.co.jp/Ceramy/image/img/A01X/G101/ENG/GRM155R61A474KE15-01A.pdf; Package: GRM15-0.1; Voltage Rating: 10V; Capacitance: 0.47uF; Category: Cap; Temperature Range High: +85°C; Temperature Range Low: -55°C; Height: 0.55mm; Device Class L2: Capacitors; Lead Free: Yes; Mouser Description: Multilayer Ceramic Capacitors MLCC - SMD/SMT 0402 0.47uF 10volts X5R 10%; Ipc Land Pattern Name: CAPC10050X50; Temperature Characteristic: X5R; Digikey Description: CAP CER 0.47UF 10V X5R 0402; Value: 0.47uF; Octopart: https://octopart.com/grm155r61a474ke15d-murata-196883; Automotive: No; Device Class L1: Passive Components; Temperature: -55°C to +85°C; RoHS: TRUE
C90 = CMP-06035-048205-1: Chip Multilayer Ceramic Capacitors for General Purpose, 1210, 100uF, X5R, 15%, 20%, 10V; Dissipation Factor: 0.035%; Packaging: Tape and Reel; Width: 2.5mm; Case/Package: 1210; Min Operating Temperature: -55°C; Depth: 2.5mm; Package Quantity: 1000; Case Code (Imperial): 1210; Voltage Rating: 10V; Dielectric Material: Ceramic; Length: 3.2mm; Lead Free: Lead Free; REACH SVHC: No SVHC; Mount: Surface Mount; Height: 2.5mm; Voltage Rating (DC): 10V; Dielectric: X5R; Thickness: 0.106inch; Weight: 0.00388oz; Material: Ceramic; Termination: SMD/SMT; Tolerance: 20%; Case Code (Metric): 3225; Voltage: 10V; Max Operating Temperature: 85°C; Capacitance: 100uF
C93 = CMP-2000-06360-2: CAP CER 47UF 6.3V X5R 1210; Dielectric Material: Ceramic; Insulation Resistance: 10.6MR; Tolerance: 10%; REACH SVHC: No SVHC; Package Quantity: 1; Radiation Hardening: No; Construction: Flat; Voltage Rating: 6.3V; Min Operating Temperature: -55°C; Packaging: Tape and Reel; RoHS Compliant: Yes; Height: 2.5mm; Case Code (Imperial): 1210; Mount: Surface Mount; Max Operating Temperature: 85°C; Width: 2.5mm; Dielectric: X5R; Length: 3.2mm; Thickness: 0.106inch; Lead Free: Lead Free; Series: GRM; Voltage Rating (DC): 6.3V; Termination: SMD/SMT; Case Code (Metric): 3225; Capacitance: 47uF; Weight: 0.000564oz; Case/Package: 1210; Voltage: 6.3V; Depth: 2.5mm
R58-R60 = CMP-010-0000-7: as R5 on sheet FPGA_PD; Case/Package: 0603
U1 = CMP-0364-00030-3: as U1 on sheet Sheet1; ComponentLink2URL: http://www.xilinx.com/support/documentation/user_guides/ug475_7Series_Pkg_Pinout.pdf; DatasheetVersion: v1.12; PartNumber: XC7A100T-2FGG484I; ComponentLink5Description: Packaging and Pinout; PackageDescription: Wire-Bond Fine-Pitch BGA, Body 23 x 23 mm, 1.0 mm Pitch; Mounting Technology: Surface Mount; ComponentLink1Description: Datasheet; ComponentLink4URL: http://www.xilinx.com/support/packagefiles/a7packages/xc7a100tfgg484pkg.txt; PackageVersion: Rev 1.8; NexusDeviceID: XC7A100T-2FGG484I; ComponentLink5URL: http://www.xilinx.com/support/documentation/user_guides/ug475_7Series_Pkg_Pinout.pdf; Code_JEDEC: MS-034-AAJ-1; Generic Part Number: XC7A100T; ComponentLink4Description: Package File; ComponentLink3Description: DC and Switching Characteristics; ComponentLink1URL: http://www.xilinx.com/support/documentation/data_sheets/ds180_7Series_Overview.pdf; CLBs (Max Distributed RAM Kb): 1188; ComponentLink2Description: Package Specification; RoHS: Pb-Free; ComponentLink3URL: http://www.xilinx.com/support/documentation/data_sheets/ds181_Artix_7_Data_Sheet.pdf; PackageReference: FGG484

## Sheet FPGA_ETH.SchDoc
size A4; SheetNumber: 7; SheetTotal: 10
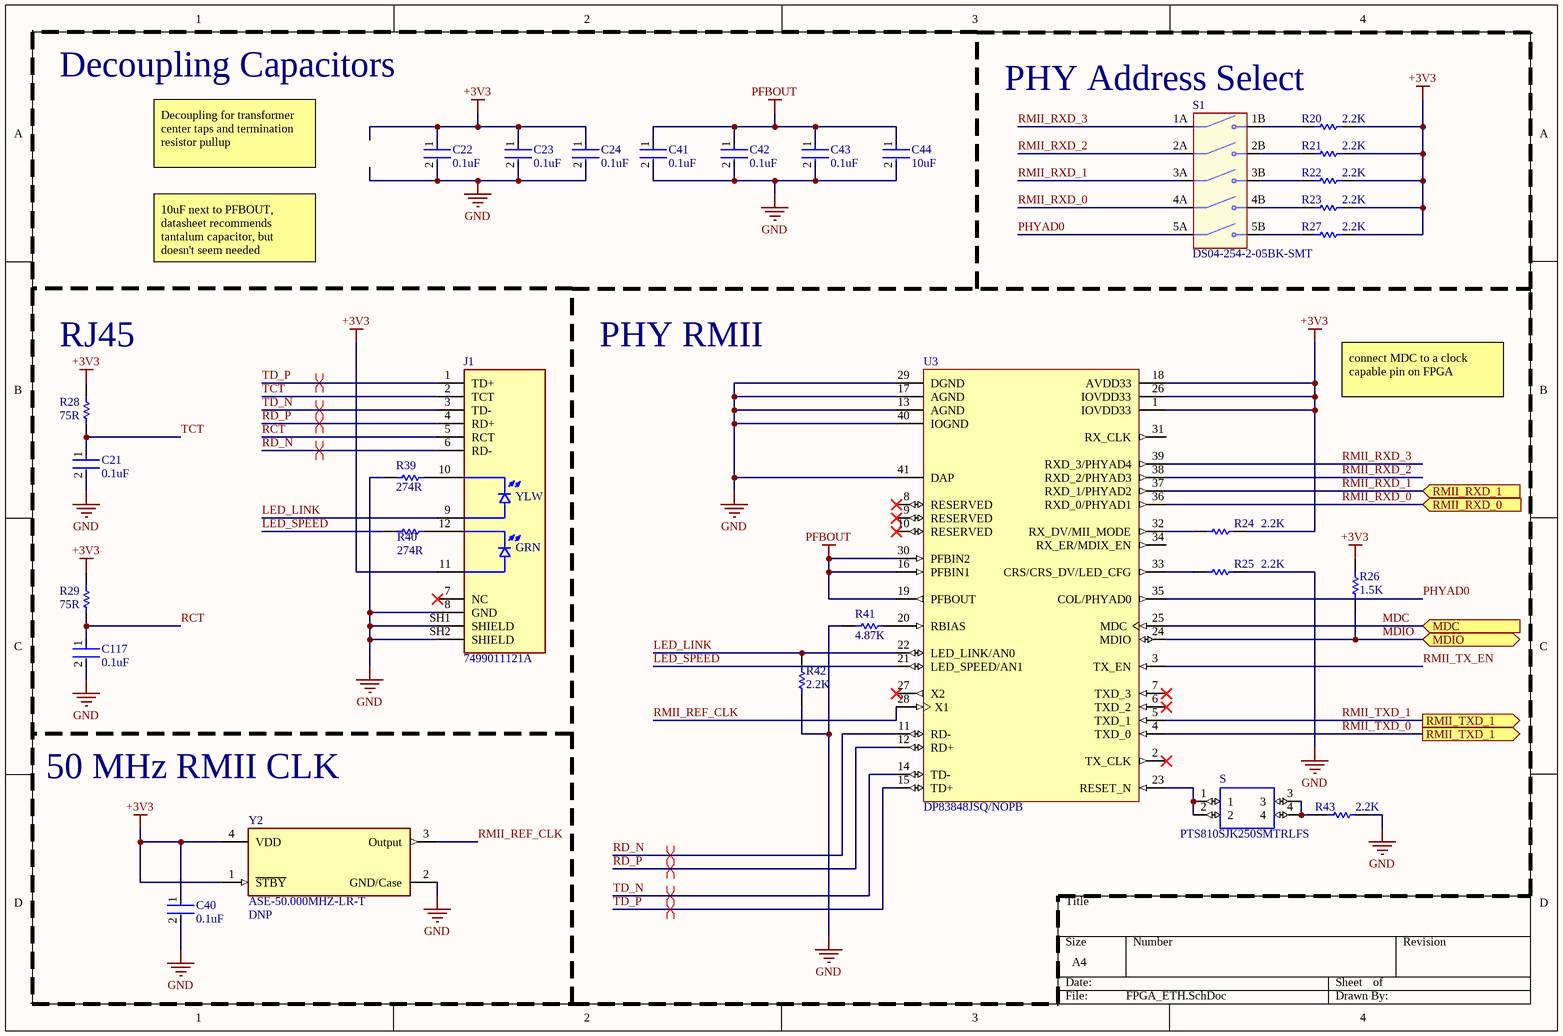
[diagram p3: FPGA_ETH.SchDoc]

### Parts
C21  0.1uF  [FP-CC0402-MFG]
C22  0.1uF  [FP-CC0402-MFG]
C23  0.1uF  [FP-CC0402-MFG]
C24  0.1uF  [FP-CC0402-MFG]
C40  0.1uF  [FP-CC0402-MFG]
C41  0.1uF  [FP-CC0402-MFG]
C42  0.1uF  [FP-CC0402-MFG]
C43  0.1uF  [FP-CC0402-MFG]
C44  10uF  [FP-GRM155-0_2-IPC_C]
C117  0.1uF  [FP-CC0402-MFG]
J1  7499011121A  [WE_7499011121A]
R20  2.2K  [RESC1005X40X25NL05T10]
R21  2.2K  [RESC1005X40X25NL05T10]
R22  2.2K  [RESC1005X40X25NL05T10]
R23  2.2K  [RESC1005X40X25NL05T10]
R24  2.2K  [RESC1005X40X25NL05T10]
R25  2.2K  [RESC1005X40X25NL05T10]
R26  1.5K  [RESC1005X40X25LL10T10]
R27  2.2K  [RESC1005X40X25NL05T10]
R28  75R  [RESC1608X55X25ML10T15]
R29  75R  [RESC1608X55X25ML10T15]
R39  274R  [RESC1608X55X25NL10T15]
R40  274R  [RESC1608X55X25NL10T15]
R41  4.87K  [RESC1005X40X25LL05T10]
R42  2.2K  [RESC1005X40X25NL05T10]
R43  2.2K  [RESC1005X40X25NL05T10]
S  PTS810SJK250SMTRLFS  [PTS810SJG250SMTRLFS]
S1  DS04-254-2-05BK-SMT  [SW_DS04-254-2-05BK-SMT]
U3  DP83848JSQ/NOPB  [RTA0040A_V]
Y2  ASE-50.000MHZ-LR-T  [FP-ASE-MFG]

### Ports
MDC (in), MDIO (bidir), RMII_RXD_0 (in), RMII_RXD_1 (in), RMII_TXD_1 (out)

### Nets
+3V3: C22.1 C23.1 C24.1 C40.1 J1.11(G_A) R20.2 R21.2 R22.2 R23.2 R24.2 R26.1 R27.2 R28.2 R29.2 U3.1(IOVDD33) U3.18(AVDD33) U3.26(IOVDD33) Y2.1(~{STBY}) Y2.4(VDD)
GND: C21.2 C22.2 C23.2 C24.2 C40.2 C41.2 C42.2 C43.2 C44.2 C117.2 J1.8(GND) J1.SH1(SHIELD) J1.SH2(SHIELD) R25.2 R39.2 R41.1 R42.2 R43.2 U3.13(AGND) U3.17(AGND) U3.29(DGND) U3.40(IOGND) U3.41(DAP) Y2.2(GND/Case)
PFBOUT: C41.1 C42.1 C43.1 C44.1 U3.16(PFBIN1) U3.19(PFBOUT) U3.30(PFBIN2)
LED_LINK: J1.9(Y_A) R42.1 U3.22(LED_LINK/AN0)
LED_SPEED: R40.2 U3.21(LED_SPEED/AN1)
MDC: U3.25(MDC) ; port MDC
MDIO: R26.2 U3.24(MDIO) ; port MDIO
PHYAD0: S1.5A(COM5) U3.35(COL/PHYAD0)
RCT: C117.1 J1.5(RCT) R29.1
RD_N: J1.6(RD-) U3.11(RD-)
RD_P: J1.4(RD+) U3.12(RD+)
RMII_REF_CLK: U3.28(X1) Y2.3(Output)
RMII_RXD_0: S1.4A(COM4) U3.36(RXD_0/PHYAD1) ; port RMII_RXD_0
RMII_RXD_1: S1.3A(COM3) U3.37(RXD_1/PHYAD2) ; port RMII_RXD_1
RMII_RXD_2: S1.2A(COM2) U3.38(RXD_2/PHYAD3)
RMII_RXD_3: S1.1A(COM1) U3.39(RXD_3/PHYAD4)
RMII_TX_EN: U3.3(TX_EN)
RMII_TXD_0: U3.4(TXD_0) U3.5(TXD_1) ; port RMII_TXD_1  [also labelled RMII_TXD_1]
TCT: C21.1 J1.2(TCT) R28.1
TD_N: J1.3(TD-) U3.14(TD-)
TD_P: J1.1(TD+) U3.15(TD+)
NetJ1_10: J1.10(Y_K) R39.1
NetJ1_12: J1.12(G_K) R40.1
NetR20_1: R20.1 S1.1B(NO1)
NetR21_1: R21.1 S1.2B(NO2)
NetR22_1: R22.1 S1.3B(NO3)
NetR23_1: R23.1 S1.4B(NO4)
NetR24_1: R24.1 U3.32(RX_DV/MII_MODE)
NetR25_1: R25.1 U3.33(CRS/CRS_DV/LED_CFG)
NetR27_1: R27.1 S1.5B(NO5)
NetR41_2: R41.2 U3.20(RBIAS)
NetR43_1: R43.1 S.3 S.4
NetS_1: S.1 S.2 U3.23(RESET_N)

Not connected (* = marked no-connect by the designer): J1 7(NC)*; U3 2(TX_CLK)* 6(TXD_2)* 7(TXD_3)* 8(RESERVED)* 9(RESERVED)* 10(RESERVED)* 27(X2)* 31(RX_CLK) 34(RX_ER/MDIX_EN)

### Layout directives
differential pair: RD_N, RD_P, TD_N, TD_P

### Notes on the sheet
- Decoupling Capacitors
- PHY Address Select
- Decoupling for transformer center taps and termination resistor pullup
- 10uF next to PFBOUT, datasheet recommends tantalum capacitor, but doesn't seem needed
- (near R28) RJ45
- PHY RMII
- connect MDC to a clock capable pin on FPGA
- 50 MHz RMII CLK
- (near Y2) DNP
- (in symbol 7499011121A) YLW; GRN

### Library data of the parts
C21-C24 C40-C43 C117 = CMP-03422-000048-1: CAP CER 0.1UF 16V X7R 0402; Manufacturer: YAGEO; Manufacturer Part Number: CC0402KRX7R7BB104; Material: Ceramic; Automotive Grade: NA; Capacitance: 100 nF; Temperature Coefficient: 30ppm/°C; Tolerance: 0.1; Value: 100 nF; Device Class L1: Passive Components; Temperature Range Low: -55°C; Device Class L3: Ceramic Capacitors; Temperature Characteristic: X7R; Ipc Land Pattern Name: CAPC10050X50; Temperature Range High: +125°C; Voltage Rating: 16 V; Temperature: -55°C to +125°C; RoHS: TRUE; Automotive: No; Height: 0.55mm; Device Class L2: Capacitors; Digikey Description: CAP CER 0.1UF 16V X7R 0402; Package: CC0402; Footprint Url: http://www.yageo.com/exep/pages/download/literatures/UPY-C_GEN_24.pdf; ComponentLink2Description: Datasheet; Category: Cap; Lead Free: Yes; Octopart: https://octopart.com/cc0402krx7r7bb104-yageo-42244624; ComponentLink2URL: http://www.yageo.com/documents/recent/UPY-GP_NP0_16V-to-50V_16.pdf; Mouser Description: 0402 0.1 uF 16 V ±10 % Tolerance X7R SMT Multilayer Ceramic Capacitor
C44 = CMP-06035-044652-1: Chip Multilayer Ceramic Capacitors for General Purpose, 0402, 10uF, X5R, 15%, 20%, 6.3V
J1 = 7499011121A: MF: {'manufacturer': u'W\xfcrth Elektronik'}; Package: None; Price: None; Value: *; MP: 7499011121A; Availability: Unavailable
R20-R25 R27 R42 R43 = CMP-2002-07567-1: Manufacturer: Yageo / Phycomp; Part Number: RC0402FR-072K2L
R26 = CMP-2002-05878-1: Manufacturer: Panasonic; Part Number: ERA2AEB152X
R28 R29 = CMP-1659-00045-1: Chip Resistor, 75 Ohm, +/- 1%, 0.1 W, -55 to 155 degC, 0603 (1608 Metric), RoHS, Tape and Reel; ComponentLink2URL: http://www.yageo.com/documents/recent/PYu-RC_Group_51_RoHS_L_04.pdf; ComponentLink1Description: Manufacturer URL; PackageReference: 0603; ComponentLink1URL: http://www.yageo.com/; ComponentLink2Description: Datasheet; PackageDescription: 2-Pin Surface Mount Device, Body 1.6 x 0.8 mm; DatasheetVersion: Rev. 4, 02/2016
R39 R40 = CMP-2000-03975-1: Manufacturer: Yageo; Part Number: RC0603FR-07274RL
R41 = CMP-2002-07716-1: Part Number: RC0402FR-074K87L; Manufacturer: Yageo / Phycomp
S = PTS810SJK250SMTRLFS: Tactile Switch SPST-NO Top Actuated Surface Mount; MF: C&K; SnapEDA_Link: https://www.snapeda.com/parts/PTS810SJK250SMTRLFS/C%26K/view-part/274682/?ref=snap; Package: None; Price: None; MP: PTS810SJK250SMTRLFS; Availability: Unavailable; Value: *
U3 = CMP-0058-00387-4: PHYTER® Mini LS Commercial Temperature Single Port 10/100 Mb/s Ethernet Transceiver, 40-pin LLP, Pb-Free, 250 Reel; Manufacturer: Texas Instruments; PowerWise: N; CompType: Interface IC; PackageTopMarking: NS*UZXYTTE#*83848JSQ; High-Reliability: Y; ComponentLink1URL: http://www.ti.com/general/docs/lit/getliterature.tsp?genericPartNumber=DP83848J&fileType=pdf; PackageReference: RTA0040A; RoHS: Y; PinCount: 40; PartNumber: DP83848JSQ/NOPB; ComponentLink1Description: Datasheet URL; PackageDescription: LLP, Quad, 6 x 6 x 0.8mm, 40 Lead, Small DAP, 0.5mm Pitch, No Pullback
Y2 = CMP-27762-004169-1: XTAL Oscillator 50MHz ±25ppm CMOS 3.3V 4-SMD 3.2mm x 2.5mm; Max Supply Voltage: 3.465V; Min Supply Voltage: 3.135V; Max Supply Current: 19mA; Load Capacitance: 15pF; Width: 0.098inch; Min Operating Temperature: -40°C; Number of Pins: 4; Frequency: 50MHz; Case/Package: SMD/SMT; REACH SVHC: No SVHC; Height: 0.047inch; Frequency Stability: 25ppm; Mount: Surface Mount; Package Quantity: 1000; Operating Supply Voltage: 3.3V; Max Operating Temperature: 85°C; Packaging: Tape and Reel; Length: 0.126inch; Series: ASE
S1 = DS04-254-2-05BK-SMT: Value: *; Price: None; Package: None; Availability: Unavailable; MP: DS04-254-2-05BK-SMT